# Altium schematic sheet Devices.SchDoc
size Tabloid
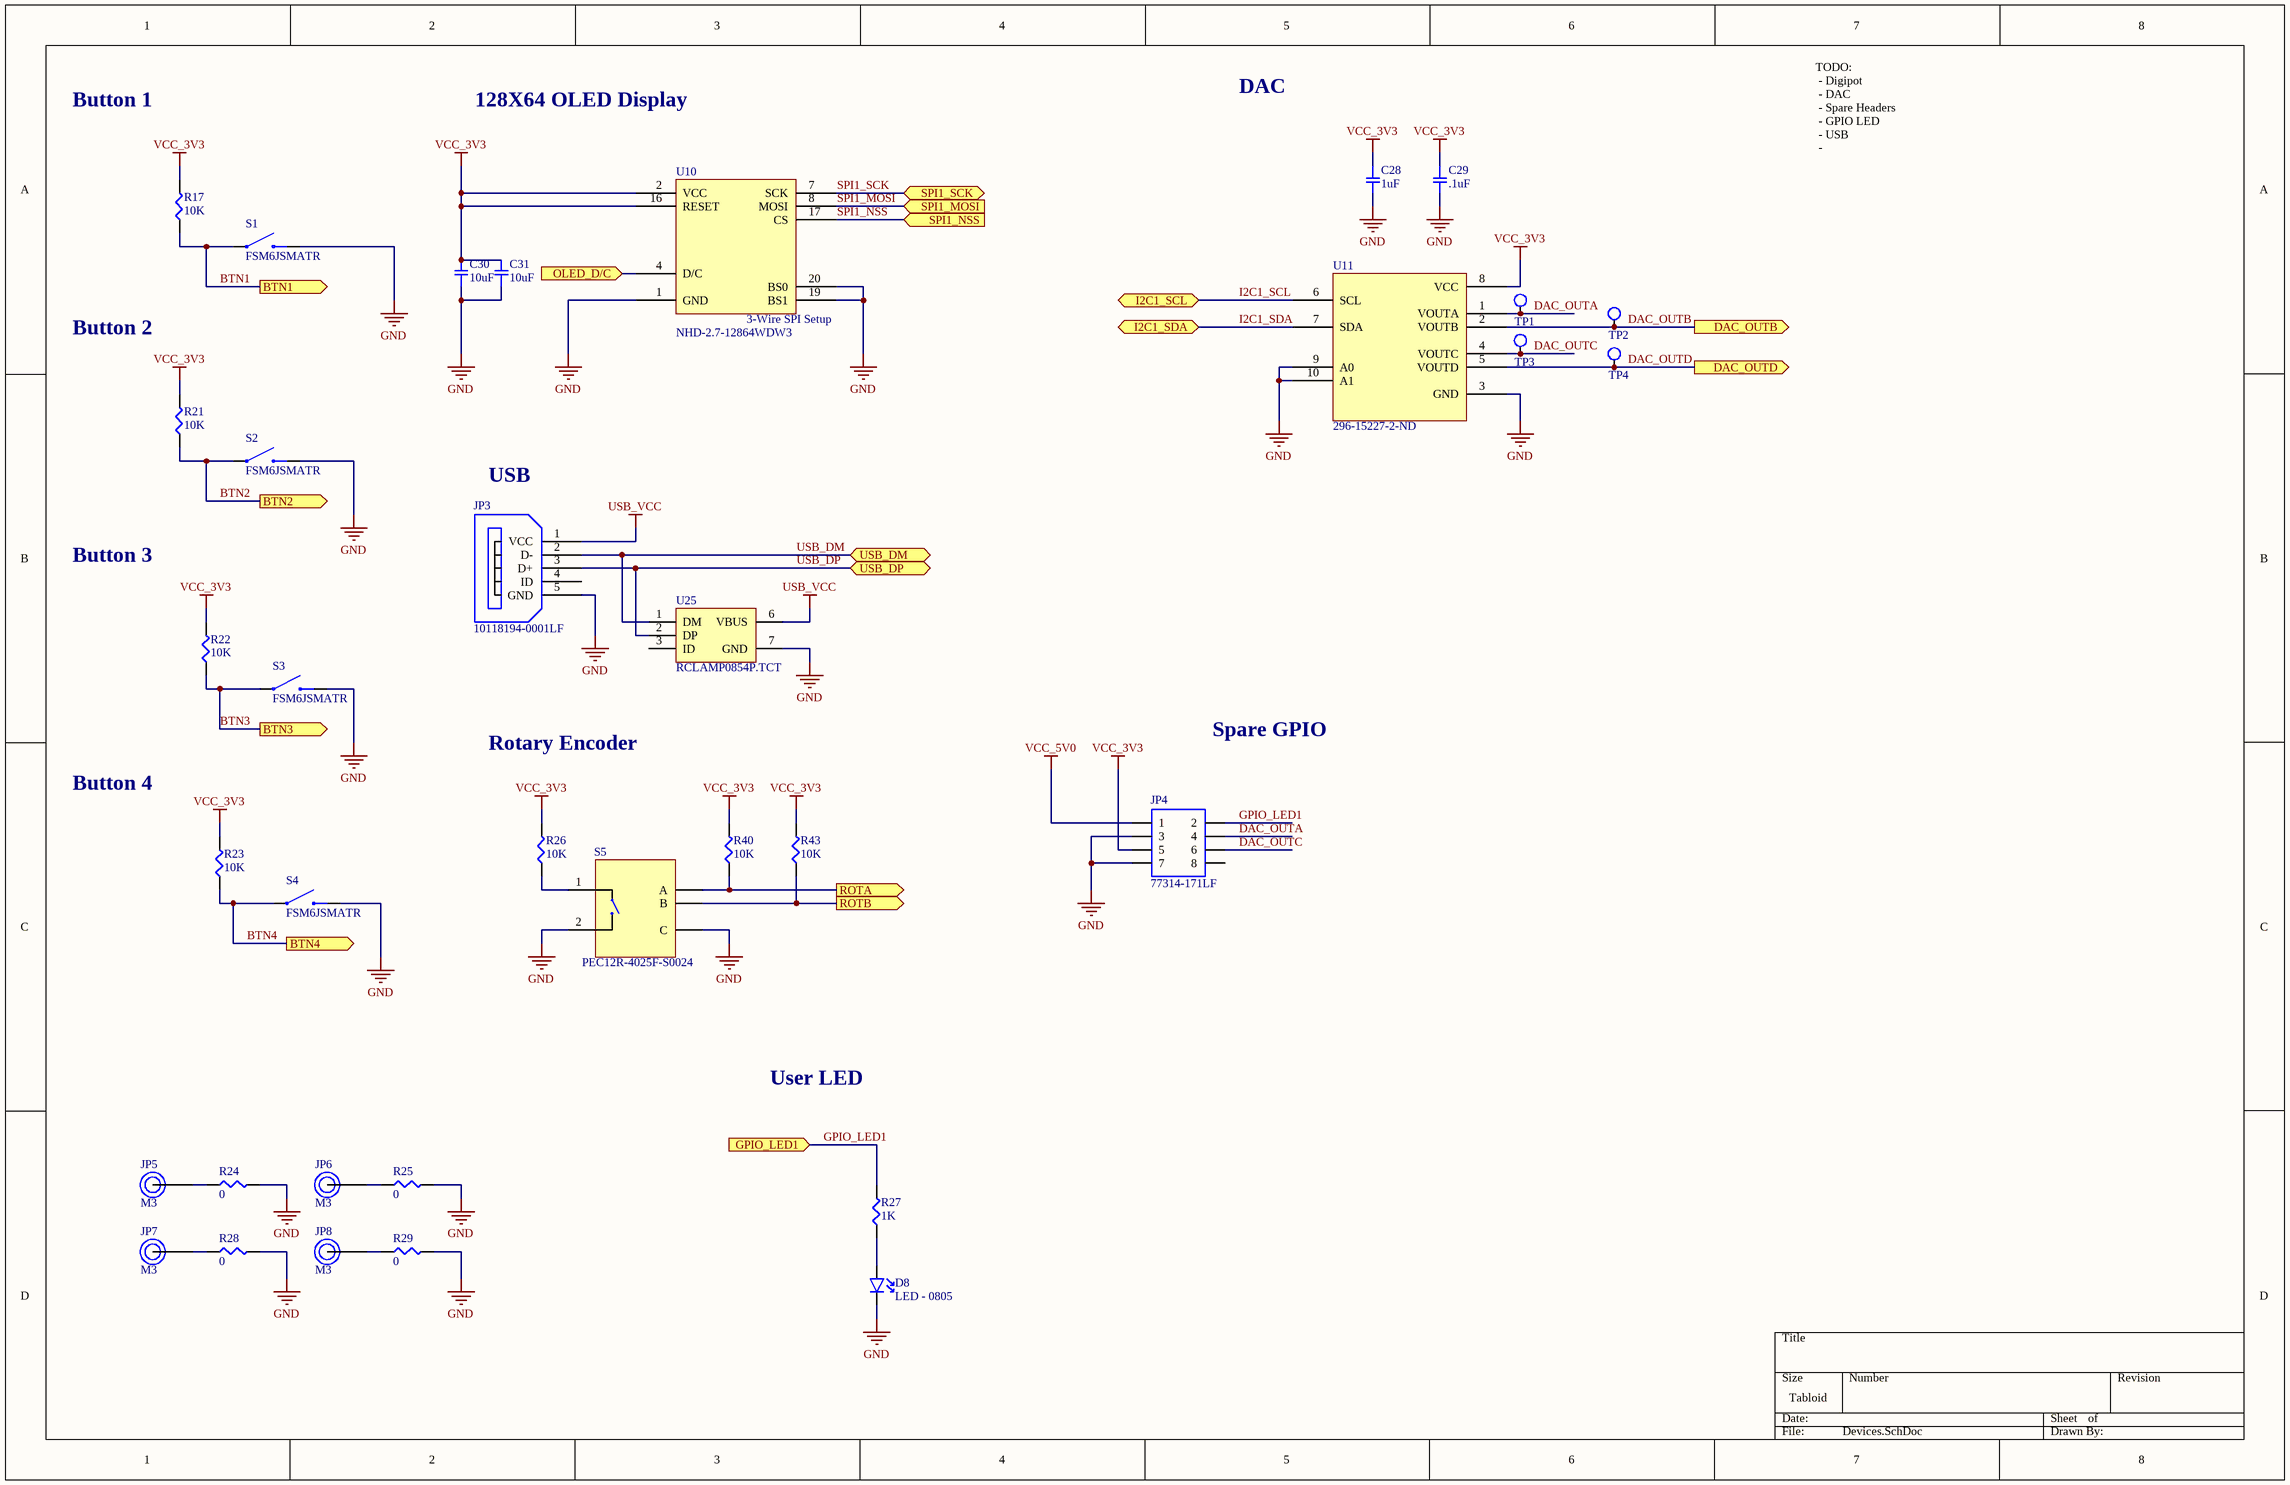
[diagram p0: Devices.SchDoc]

## Parts
C28  1uF  [SMD-0603C]
C29  .1uF  [SMD-0603C]
C30  10uF  [SMD-0805C]
C31  10uF  [SMD-0805C]
D8  LED - 0805  [0805 SMD]
JP3  10118194-0001LF  [014-439]
JP4  77314-171LF  [2x4 Pin Header]
JP5  M3  [M3-Hole]
JP6  M3  [M3-Hole]
JP7  M3  [M3-Hole]
JP8  M3  [M3-Hole]
R17  10K  [SMD-0805-RES]
R21  10K  [SMD-0805-RES]
R22  10K  [SMD-0805-RES]
R23  10K  [SMD-0805-RES]
R24  0  [SMD-0603-RES]
R25  0  [SMD-0603-RES]
R26  10K  [SMD-0805-RES]
R27  1K  [SMD-0603-RES]
R28  0  [SMD-0603-RES]
R29  0  [SMD-0603-RES]
R40  10K  [SMD-0805-RES]
R43  10K  [SMD-0805-RES]
S1  FSM6JSMATR  [TACTILE 4 PIN SMD 6MM]
S2  FSM6JSMATR  [TACTILE 4 PIN SMD 6MM]
S3  FSM6JSMATR  [TACTILE 4 PIN SMD 6MM]
S4  FSM6JSMATR  [TACTILE 4 PIN SMD 6MM]
S5  PEC12R-4025F-S0024  [PEC12R-4025F-S]
TP1  TEST POINT 1MM  [TEST POINT]  (value not drawn)
TP2  TEST POINT 1MM  [TEST POINT]  (value not drawn)
TP3  TEST POINT 1MM  [TEST POINT]  (value not drawn)
TP4  TEST POINT 1MM  [TEST POINT]  (value not drawn)
U10  NHD-2.7-12864WDW3  [NHD-2.7-12864WDW3]
U11  296-15227-2-ND  [10-VSSOP]
U25  RCLAMP0854P.TCT  [6-UFDFN]

## Ports
BTN1 (out), BTN2 (out), BTN3 (out), BTN4 (out), DAC_OUTB (out), DAC_OUTD (out), GPIO_LED1 (in), I2C1_SCL (bidir), I2C1_SDA (bidir), OLED_D/C (in), ROTA (out), ROTB (out), SPI1_MOSI (in), SPI1_NSS (in), SPI1_SCK (bidir), USB_DM (bidir), USB_DP (bidir)

## Nets
GND: C28.2 C29.2 C30.1 C31.1 D8.2 JP3.5(GND) JP4.3 JP4.7 R24.2 R25.2 R28.2 R29.2 S1.2 S2.2 S3.2 S4.2 S5.2 S5.C U10.1(GND) U10.19(BS1) U10.20(BS0) U11.3(GND) U11.9(A0) U11.10(A1) U25.7(GND)
USB_VCC: JP3.1(VCC) U25.6(VBUS)
VCC_3V3: C28.1 C29.1 C30.2 C31.2 JP4.5 R17.2 R21.2 R22.2 R23.2 R26.2 R40.2 R43.2 U10.2(VCC) U10.16(RESET) U11.8(VCC)
VCC_5V0: JP4.1
BTN1: R17.1 S1.1 ; port BTN1
BTN2: R21.1 S2.1 ; port BTN2
BTN3: R22.1 S3.1 ; port BTN3
BTN4: R23.1 S4.1 ; port BTN4
DAC_OUTA: JP4.4 TP1.1 U11.1(VOUTA)
DAC_OUTB: TP2.1 U11.2(VOUTB) ; port DAC_OUTB
DAC_OUTC: JP4.6 TP3.1 U11.4(VOUTC)
DAC_OUTD: TP4.1 U11.5(VOUTD) ; port DAC_OUTD
GPIO_LED1: JP4.2 R27.2 ; port GPIO_LED1
I2C1_SCL: U11.6(SCL) ; port I2C1_SCL
I2C1_SDA: U11.7(SDA) ; port I2C1_SDA
OLED_D/C: U10.4(D/C) ; port OLED_D/C
ROTA: R40.1 S5.A ; port ROTA
ROTB: R43.1 S5.B ; port ROTB
SPI1_MOSI: U10.8(MOSI) ; port SPI1_MOSI
SPI1_NSS: U10.17(CS) ; port SPI1_NSS
SPI1_SCK: U10.7(SCK) ; port SPI1_SCK
USB_DM: JP3.2(D-) U25.1(DM) ; port USB_DM
USB_DP: JP3.3(D+) U25.2(DP) ; port USB_DP
NetD8_1: D8.1 R27.1
NetJP5_1: JP5.1 R24.1
NetJP6_1: JP6.1 R25.1
NetJP7_1: JP7.1 R28.1
NetJP8_1: JP8.1 R29.1
NetR26_1: R26.1 S5.1

Not connected (* = marked no-connect by the designer): JP3 4(ID); JP4 8; U25 3(ID)

## Notes on the sheet
- DAC
- Button 1
- 128X64 OLED Display
- TODO:
  - Digipot
  - DAC
  - Spare Headers
  - GPIO LED
  - USB
  -
- Button 2
- USB
- Button 3
- Rotary Encoder
- Spare GPIO
- Button 4
- User LED
- (in symbol DISP OLED GRAPHIC 128X64 WHT) 3-Wire SPI Setup

## Library data of the parts
C28 C29 = GCJ188R71H223KA01D: CAP CER 0.022UF 50V X7R 0603; Manufacturer: Murata Electronics North America; Factory Stock: 0; Unit Price (USD): 0.22; Minimum Quantity: 1; Value: 0.022µF; Tolerance: ±10%; Datasheets: http://www.murata.com/~/media/webrenewal/support/library/catalog/products/capacitor/mlcc/c03e.ashx; Image: //media.digikey.com/Renders/Murata%20Renders/0603%28LQG18%29.jpg; Digi-Key Part Number: 490-5851-1-ND; Part Number: GCJ188R71H223KA01D; Quantity Available: 7651; @ qty: 0; Packaging: Cut Tape (CT); Series: GCJ; Part Status: Active; Voltage: 50V; Temperature Coefficient: X7R; Operating Temperature: -55°C ~ 125°C; Features: Soft Termination; Ratings: AEC-Q200; Applications: Automotive, Boardflex Sensitive; Mounting Type: Surface Mount, MLCC; Package / Case: 0603 (1608 Metric); Size / Dimension: 0.063" L x 0.031" W (1.60mm x 0.80mm); Height - Seated (Max): -; Thickness (Max): 0.031" (0.80mm); Lead Spacing: -; Lead Style: -
C30 C31 = LLA219R71C104MA01L: CAP CER 0.1UF 16V X7R 0805; Manufacturer: Murata Electronics North America; Factory Stock: 0; Unit Price (USD): 0.36; Minimum Quantity: 1; Value: 0.10µF; Tolerance: ±20%; Datasheets: http://www.murata.com/~/media/webrenewal/support/library/catalog/products/capacitor/mlcc/c02e.pdf; Image: //media.digikey.com/Renders/Murata%20Renders/0805-LLA.jpg; Digi-Key Part Number: 490-4414-1-ND; Part Number: LLA219R71C104MA01L; Quantity Available: 7094; @ qty: 0; Packaging: Cut Tape (CT); Series: LLA; Part Status: Active; Voltage: 16V; Temperature Coefficient: X7R; Operating Temperature: -55°C ~ 125°C; Features: Low ESL (Multi-Terminal); Ratings: -; Applications: Bypass, Decoupling; Mounting Type: Surface Mount, MLCC; Package / Case: 0805 (2012 Metric); Size / Dimension: 0.079" L x 0.049" W (2.00mm x 1.25mm); Height - Seated (Max): -; Thickness (Max): 0.037" (0.95mm); Lead Spacing: -; Lead Style: -
JP3 = CONN USB: CONN RCPT USB2.0 MICRO B SMD R/A
JP4 = CONN HEADER VERT 2x4: CONN HEADER VERT 8POS 2.54MM
JP5-JP8 = HOLE MOUNT M3: M3 MOUNT HOLE SIZE
R17 R21-R23 R26 R40 R43 = ERJ-6BWFR100V: RES SMD 0.1 OHM 1% 1/2W 0805; Manufacturer: Panasonic Electronic Components; Factory Stock: 0; Unit Price (USD): 0.15268; @ qty: 1500; Minimum Quantity: 1; Value: 0.1; Power (Watts): 0.5W, 1/2W; Temperature Coefficient: ±200ppm/°C; Part Number: ERJ-6BWFR100V; Datasheets: https://industrial.panasonic.com/cdbs/www-data/pdf/RDA0000/AOA0000C239.pdf; Image: //media.digikey.com/Renders/Panasonic%20Renders/ERJ-0805%20Pkg.jpg; Digi-Key Part Number: P17589CT-ND; Quantity Available: 12233; Packaging: Cut Tape (CT); Series: ERJ; Part Status: Active; Tolerance: ±1%; Composition: Thick Film; Features: Automotive AEC-Q200, Current Sense; Operating Temperature: -55°C ~ 155°C; Package / Case: 0805 (2012 Metric); Supplier Device Package: 0805; Size / Dimension: 0.079" L x 0.049" W (2.00mm x 1.25mm); Height - Seated (Max): 0.030" (0.75mm); Number of Terminations: 2; Failure Rate: -
R24 R25 R28 R29 = ERJ-3BQFR33V: RES SMD 0.33 OHM 1% 1/4W 0603; Manufacturer: Panasonic Electronic Components; Unit Price (USD): 0.05386; @ qty: 1500; Minimum Quantity: 1; Value: 0.33; Power (Watts): 0.25W, 1/4W; Temperature Coefficient: ±300ppm/°C; Part Number: ERJ-3BQFR33V; Datasheets: https://industrial.panasonic.com/cdbs/www-data/pdf/RDA0000/AOA0000C239.pdf; Image: //media.digikey.com/Photos/Panasonic%20Photos/MFG_ERJ-P6W%20Series.jpg; Digi-Key Part Number: P17396CT-ND; Quantity Available: 1368; Factory Stock: 0; Packaging: Cut Tape (CT); Series: ERJ; Part Status: Active; Tolerance: ±1%; Composition: Thick Film; Features: Automotive AEC-Q200, Current Sense; Operating Temperature: -55°C ~ 125°C; Package / Case: 0603 (1608 Metric); Supplier Device Package: 0603; Size / Dimension: 0.063" L x 0.031" W (1.60mm x 0.80mm); Height - Seated (Max): 0.022" (0.55mm); Number of Terminations: 2; Failure Rate: -
R27 = ERJ-3BQF1R5V: RES SMD 1.5 OHM 1% 1/4W 0603; Manufacturer: Panasonic Electronic Components; Factory Stock: 0; Unit Price (USD): 0.06115; @ qty: 1500; Minimum Quantity: 1; Value: 1.5; Power (Watts): 0.25W, 1/4W; Temperature Coefficient: ±200ppm/°C; Part Number: ERJ-3BQF1R5V; Datasheets: https://industrial.panasonic.com/cdbs/www-data/pdf/RDA0000/AOA0000C239.pdf; Image: //media.digikey.com/Photos/Panasonic%20Photos/MFG_ERJ-P6W%20Series.jpg; Digi-Key Part Number: P15988CT-ND; Quantity Available: 1591; Packaging: Cut Tape (CT); Series: ERJ; Part Status: Active; Tolerance: ±1%; Composition: Thick Film; Features: Automotive AEC-Q200, Current Sense; Operating Temperature: -55°C ~ 125°C; Package / Case: 0603 (1608 Metric); Supplier Device Package: 0603; Size / Dimension: 0.063" L x 0.031" W (1.60mm x 0.80mm); Height - Seated (Max): 0.022" (0.55mm); Number of Terminations: 2; Failure Rate: -
S1-S4 = SWITCH TACTILE SPST: SWITCH TACTILE SPST-NO 0.05A 24V
S5 = RTRY ENCDR MECH 24PPR: Rotary Encoder Mechanical 24 Quadrature (Incremental) Vertical
TP1-TP4 = TEST POINT 1MM: 1mm pad for test points
U10 = DISP OLED GRAPHIC 128X64 WHT: Graphic LCD Display Module  White OLED - Passive Matrix Parallel/Serial 2.7" (68.58mm) 128 x 64
U11 = IC DAC DAC7574IDGSR: IC DAC 12BIT V-OUT 10VSSOP
U25 = IC RCLAMP0854P.TCT: TVS DIODE 5.5VWM 30VC SLP1616P6